# EAGLE design pecl_termination (EAGLE 9.2.2)
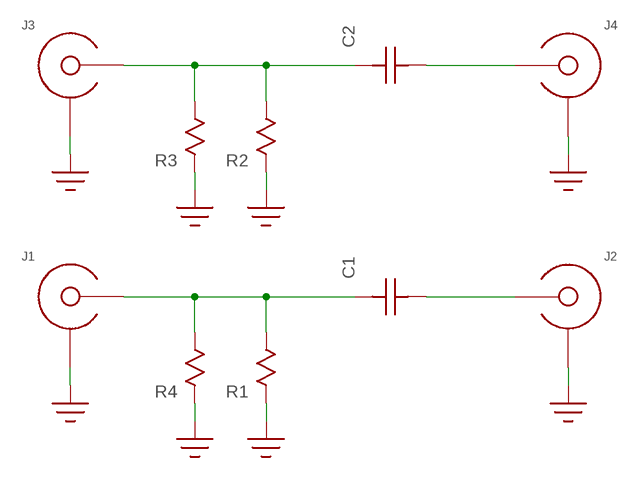
[diagram p0: schematic, sheet 1]

## Parts
C1  C0805  [0805]
C2  C0805  [0805]
J1  EDGE_LAUNCH_JACK  [EDGE_LAUNCH_RF_CON]
J2  EDGE_LAUNCH_JACK  [EDGE_LAUNCH_RF_CON]
J3  EDGE_LAUNCH_JACK  [EDGE_LAUNCH_RF_CON]
J4  EDGE_LAUNCH_JACK  [EDGE_LAUNCH_RF_CON]
R1  R0805  [R0805]
R2  R0805  [R0805]
R3  R0805  [R0805]
R4  R0805  [R0805]

## Nets
GND: J1.GND@1(SHIELD) J1.GND@2(SHIELD) J1.GND@3(SHIELD) J1.GND@4(SHIELD) J1.GND@5(SHIELD) J1.GND@6(SHIELD) J1.GND@7(SHIELD) J1.GND@8(SHIELD) J1.GND@9(SHIELD) J1.GND@10(SHIELD) J1.GND@11(SHIELD) J1.GND@12(SHIELD) J1.SHIELD@1(SHIELD) J1.SHIELD@2(SHIELD) J2.GND@1(SHIELD) J2.GND@2(SHIELD) J2.GND@3(SHIELD) J2.GND@4(SHIELD) J2.GND@5(SHIELD) J2.GND@6(SHIELD) J2.GND@7(SHIELD) J2.GND@8(SHIELD) J2.GND@9(SHIELD) J2.GND@10(SHIELD) J2.GND@11(SHIELD) J2.GND@12(SHIELD) J2.SHIELD@1(SHIELD) J2.SHIELD@2(SHIELD) J3.GND@1(SHIELD) J3.GND@2(SHIELD) J3.GND@3(SHIELD) J3.GND@4(SHIELD) J3.GND@5(SHIELD) J3.GND@6(SHIELD) J3.GND@7(SHIELD) J3.GND@8(SHIELD) J3.GND@9(SHIELD) J3.GND@10(SHIELD) J3.GND@11(SHIELD) J3.GND@12(SHIELD) J3.SHIELD@1(SHIELD) J3.SHIELD@2(SHIELD) J4.GND@1(SHIELD) J4.GND@2(SHIELD) J4.GND@3(SHIELD) J4.GND@4(SHIELD) J4.GND@5(SHIELD) J4.GND@6(SHIELD) J4.GND@7(SHIELD) J4.GND@8(SHIELD) J4.GND@9(SHIELD) J4.GND@10(SHIELD) J4.GND@11(SHIELD) J4.GND@12(SHIELD) J4.SHIELD@1(SHIELD) J4.SHIELD@2(SHIELD) R1.P$1 R2.P$1 R3.P$1 R4.P$1
N$1: C1.P$2 J1.CENTER R1.P$2 R4.P$2
N$2: C1.P$1 J2.CENTER
N$3: C2.P$2 J3.CENTER R2.P$2 R3.P$2
N$4: C2.P$1 J4.CENTER

## Library data of the parts
C1 C2 = yapo:C
J1-J4 = yapo:EDGE_LAUNCH_JACK
R1-R4 = yapo:R

## Board
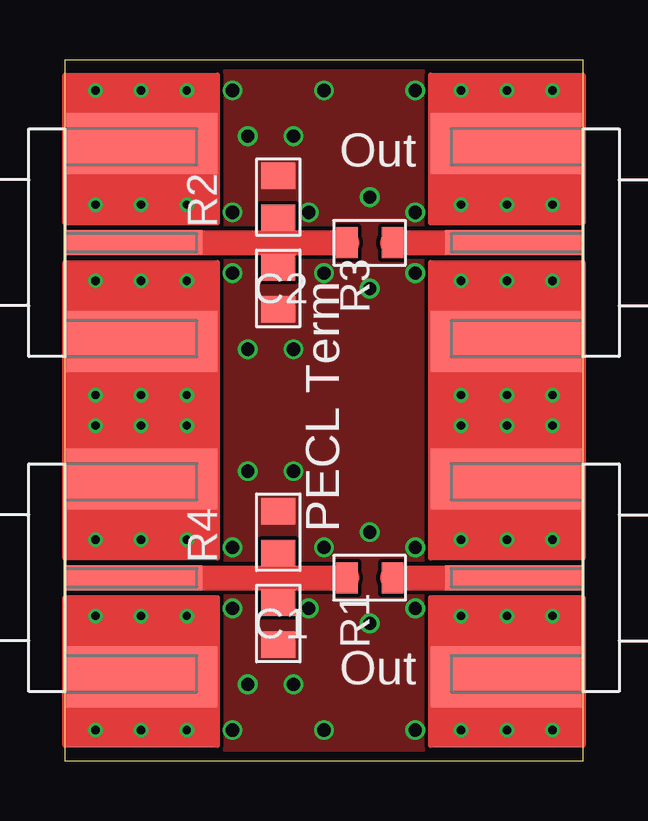
[diagram p1: board, top side]
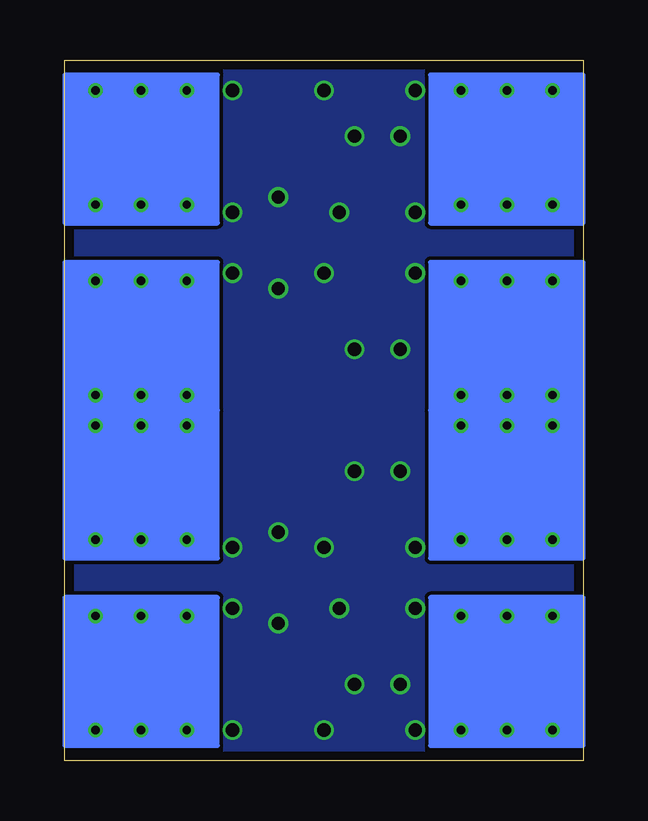
[diagram p2: board, bottom side, seen from below]

Size 21.59 x 29.21 mm. Coordinates in mm from the lower left corner, seen from the top.
Outline: 0,0 21.59,0 21.59,29.21 0,29.21 0,0
Copper layers (1*16): Top 0.035559375mm / dielectric 1.6mm / Bottom 0.035559375mm
Design rules "oshpark-2layer *": minimum track width 6mil, minimum drill 10mil, track to track 6mil, track to pad 6mil, pad to pad 6mil, via to via 6mil, smd to smd 6mil, copper to edge 15mil, drill to drill 6mil, minimum pad ring 5mil, minimum via ring 5mil, stop-mask expansion 2.5mil, vias tented up to drill 30mil, thermal gap 10mil

### Footprints (pad centres in the part's own frame; a part is rotated, then mirrored left to right if it is on the bottom)
0805 = smd 0.9 x 1.3: P$1 -0.95,0; P$2 0.95,0
EDGE_LAUNCH_RF_CON = smd 5.715 x 1.041: CENTER -2.875,0 | drill 0.35: GND@1 -5.08,1.587; GND@2 -3.175,1.587; GND@3 -1.27,1.587; GND@4 -5.08,-1.587; GND@5 -3.175,-1.587; GND@6 -1.27,-1.587; GND@7 -5.08,6.35; GND@8 -3.175,6.35; GND@9 -1.27,6.35; GND@10 -5.08,-6.35; GND@11 -3.175,-6.35; GND@12 -1.27,-6.35 | smd 6.35 x 2.54: SHIELD@1 -3.175,-4.128; SHIELD@2 -3.175,4.128
R0805 = smd 1.1 x 1.4: P$1 -0.875,0; P$2 0.875,0

### Placement (x,y rotation side)
C1  12.7,7.62 180 top
C2  12.7,21.59 180 top
J1  0,7.62 180 top
J2  21.59,7.62 0 top
J3  0,21.59 180 top
J4  21.59,21.59 0 top
R1  8.89,9.53 270 top
R2  8.89,19.68 90 top
R3  8.89,23.5 270 top
R4  8.89,5.71 90 top

### Tracks (layer width: path | path; a pad name or v marks a point on that pad's centre or on a via)
GND  (via drill 0.55)
  other vias: 6.99,27.94 10.79,27.94 14.61,27.94 6.99,1.27 14.61,1.27 10.79,1.27 6.99,22.86 10.16,22.86 14.61,22.86 6.99,20.32 10.79,20.32 6.99,8.89 6.99,6.35 10.16,6.35 10.79,8.89 14.61,8.89 14.61,6.35 14.61,20.32 7.62,17.14 9.53,17.14 7.62,12.06 9.53,12.06 12.7,23.5 12.7,19.68 12.7,9.53 12.7,5.71 7.62,3.17 9.53,3.17 7.62,26.04 9.53,26.04
  pour Top (no thermals): 0,29.21 21.59,29.21 21.59,0 0,0
  pour Bottom (no thermals): 0,0 21.59,0 21.59,29.21 0,29.21
N$1
  Top 1.041: J1.CENTER 8.89,7.62 | 8.89,7.62 C1.P$2 | R1.P$2 8.89,7.62 | R4.P$2 8.89,7.62
N$2
  Top 1.041: C1.P$1 J2.CENTER
N$3
  Top 1.041: J3.CENTER 8.89,21.59 | 8.89,21.59 C2.P$2 | R2.P$2 8.89,21.59 | R3.P$2 8.89,21.59
N$4
  Top 1.041: C2.P$1 J4.CENTER

### Text on the board
tPlace: Out | PECL Term | Out